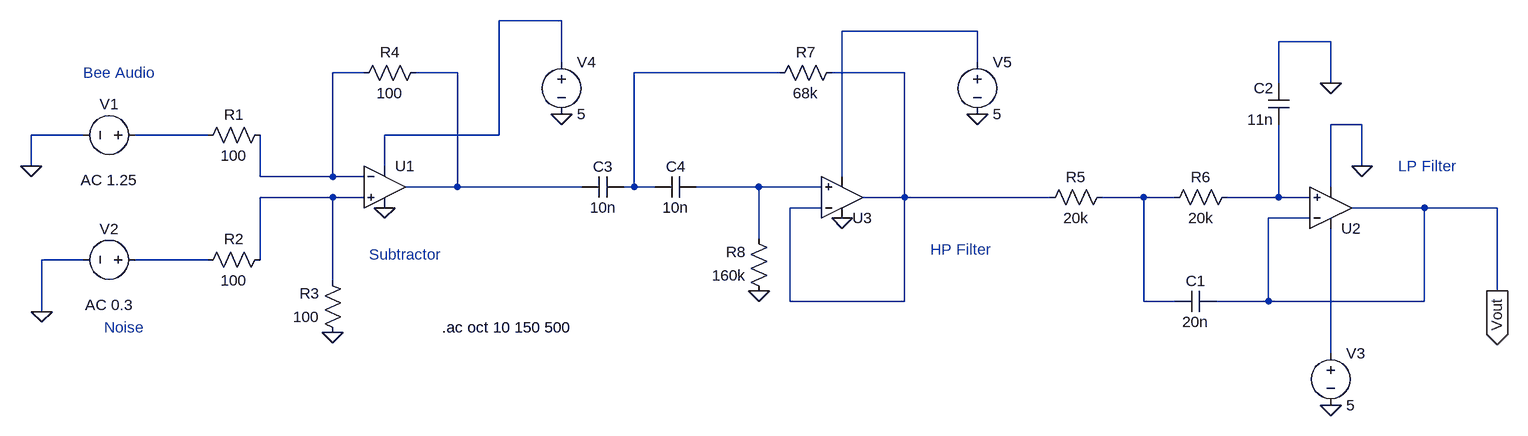
[diagram p0: schematic Praxis_BeeFreq.asc]
Praxis_BeeFreq.asc, the LTspice schematic file:
Version 4
SHEET 1 2124 680
WIRE 592 0 496 0
WIRE 1232 16 1024 16
WIRE 1776 32 1696 32
WIRE 592 64 592 0
WIRE 1232 64 1232 16
WIRE 288 80 240 80
WIRE 432 80 368 80
WIRE 928 80 704 80
WIRE 1120 80 1008 80
WIRE 1696 96 1696 32
WIRE 1776 96 1776 32
WIRE 1824 160 1776 160
WIRE -144 176 -224 176
WIRE 48 176 -64 176
WIRE 496 176 496 0
WIRE 496 176 320 176
WIRE -224 224 -224 176
WIRE 320 224 320 176
WIRE 1824 224 1824 160
WIRE 128 240 128 176
WIRE 240 240 240 80
WIRE 240 240 128 240
WIRE 288 240 240 240
WIRE 1024 240 1024 16
WIRE 432 256 432 80
WIRE 432 256 352 256
WIRE 624 256 432 256
WIRE 704 256 704 80
WIRE 704 256 688 256
WIRE 736 256 704 256
WIRE 896 256 800 256
WIRE 992 256 896 256
WIRE 1776 256 1776 160
WIRE 240 272 128 272
WIRE 288 272 240 272
WIRE 1120 272 1120 80
WIRE 1120 272 1056 272
WIRE 1344 272 1120 272
WIRE 1488 272 1424 272
WIRE 1536 272 1488 272
WIRE 1696 272 1696 160
WIRE 1696 272 1616 272
WIRE 1744 272 1696 272
WIRE 992 288 944 288
WIRE 1920 288 1808 288
WIRE 2032 288 1920 288
WIRE 1744 304 1680 304
WIRE 896 336 896 256
WIRE -144 368 -208 368
WIRE 48 368 -64 368
WIRE 128 368 128 272
WIRE 240 400 240 272
WIRE 2032 416 2032 288
WIRE 944 432 944 288
WIRE 1120 432 1120 272
WIRE 1120 432 944 432
WIRE 1488 432 1488 272
WIRE 1536 432 1488 432
WIRE 1680 432 1680 304
WIRE 1680 432 1600 432
WIRE 1920 432 1920 288
WIRE 1920 432 1680 432
WIRE -208 448 -208 368
WIRE 1776 512 1776 320
FLAG -224 224 0
FLAG -208 448 0
FLAG 1776 96 0
FLAG 240 480 0
FLAG 320 288 0
FLAG 1824 224 0
FLAG 592 144 0
FLAG 1776 592 0
FLAG 2032 416 Vout
IOPIN 2032 416 Out
FLAG 896 416 0
FLAG 1024 304 0
FLAG 1232 144 0
SYMBOL Voltage -48 176 R90
WINDOW 0 -32 56 VBottom 2
WINDOW 3 32 56 Invisible 2
WINDOW 123 54 56 VTop 2
SYMATTR InstName V1
SYMATTR Value SINE()
SYMATTR Value2 AC 1.25
SYMBOL Voltage -48 368 R90
WINDOW 0 -32 56 VBottom 2
WINDOW 3 32 56 Invisible 2
WINDOW 123 54 56 VTop 2
SYMATTR InstName V2
SYMATTR Value SINE(0 0.05 250)
SYMATTR Value2 AC 0.3
SYMBOL Res 144 160 R90
WINDOW 0 0 56 VBottom 2
WINDOW 3 32 56 VTop 2
SYMATTR InstName R1
SYMATTR Value 100
SYMBOL Res 144 352 R90
WINDOW 0 0 56 VBottom 2
WINDOW 3 32 56 VTop 2
SYMATTR InstName R2
SYMATTR Value 100
SYMBOL Res 256 496 R180
WINDOW 0 36 76 Left 2
WINDOW 3 36 40 Left 2
SYMATTR InstName R3
SYMATTR Value 100
SYMBOL Res 384 64 R90
WINDOW 0 0 56 VBottom 2
WINDOW 3 32 56 VTop 2
SYMATTR InstName R4
SYMATTR Value 100
SYMBOL Res 1440 256 R90
WINDOW 0 0 56 VBottom 2
WINDOW 3 32 56 VTop 2
SYMATTR InstName R5
SYMATTR Value 20k
SYMBOL Res 1632 256 R90
WINDOW 0 0 56 VBottom 2
WINDOW 3 32 56 VTop 2
SYMATTR InstName R6
SYMATTR Value 20k
SYMBOL Cap 1600 416 R90
WINDOW 0 0 32 VBottom 2
WINDOW 3 32 32 VTop 2
SYMATTR InstName C1
SYMATTR Value 20n
SYMBOL Cap 1712 160 R180
WINDOW 0 24 56 Left 2
WINDOW 3 24 8 Left 2
SYMATTR InstName C2
SYMATTR Value 11n
SYMBOL OpAmps/UniversalOpAmp 320 256 R0
SYMATTR InstName U1
SYMBOL OpAmps/UniversalOpAmp 1776 288 M180
SYMATTR InstName U2
SYMBOL Voltage 1776 496 R0
SYMATTR InstName V3
SYMATTR Value 5
SYMBOL Voltage 592 48 R0
SYMATTR InstName V4
SYMATTR Value 5
SYMBOL Cap 688 240 R90
WINDOW 0 0 32 VBottom 2
WINDOW 3 32 32 VTop 2
SYMATTR InstName C3
SYMATTR Value 10n
SYMBOL Res 1024 64 R90
WINDOW 0 0 56 VBottom 2
WINDOW 3 32 56 VTop 2
SYMATTR InstName R7
SYMATTR Value 68k
SYMBOL Res 912 432 R180
WINDOW 0 36 76 Left 2
WINDOW 3 36 40 Left 2
SYMATTR InstName R8
SYMATTR Value 160k
SYMBOL Cap 800 240 R90
WINDOW 0 0 32 VBottom 2
WINDOW 3 32 32 VTop 2
SYMATTR InstName C4
SYMATTR Value 10n
SYMBOL Voltage 1232 48 R0
SYMATTR InstName V5
SYMATTR Value 5
SYMBOL OpAmps/UniversalOpAmp 1024 272 M180
SYMATTR InstName U3
TEXT -144 80 Left 2 ;Bee Audio
TEXT -112 472 Left 2 ;Noise
TEXT 296 360 Left 2 ;Subtractor
TEXT 1880 224 Left 2 ;LP Filter
TEXT 408 472 Left 2 !.ac oct 10 150 500
TEXT 1160 352 Left 2 ;HP Filter

The netlist it stands for:
* Praxis_BeeFreq.asc
V1 N007 0 SINE() AC 1.25
V2 N012 0 SINE(0 0.05 250) AC 0.3
R1 N003 N007 100
R2 N009 N012 100
R3 0 N009 100
R4 N004 N003 100
R5 N010 N006 20k
R6 N011 N010 20k
C1 Vout N010 20n
C2 N011 0 11n
XU1 N009 N003 N001 0 N004 level1 Avol=1Meg GBW=10Meg Vos=0 En=0 Enk=0 In=0 Ink=0 Rin=500Meg  ; pins In+ In- V+ V- OUT
XU2 N011 Vout N013 0 Vout level1 Avol=1Meg GBW=10Meg Vos=0 En=0 Enk=0 In=0 Ink=0 Rin=500Meg  ; pins In+ In- V+ V- OUT
V3 N013 0 5
V4 N001 0 5
C3 N005 N004 10n
R7 N006 N005 68k
R8 0 N008 160k
C4 N008 N005 10n
V5 N002 0 5
XU3 N008 N006 0 N002 N006 level1 Avol=1Meg GBW=10Meg Vos=0 En=0 Enk=0 In=0 Ink=0 Rin=500Meg  ; pins In+ In- V+ V- OUT
* Bee Audio
* Noise
* Subtractor
* LP Filter
.ac oct 10 150 500
* HP Filter
.lib UniversalOpAmp1.lib
.backanno
.end